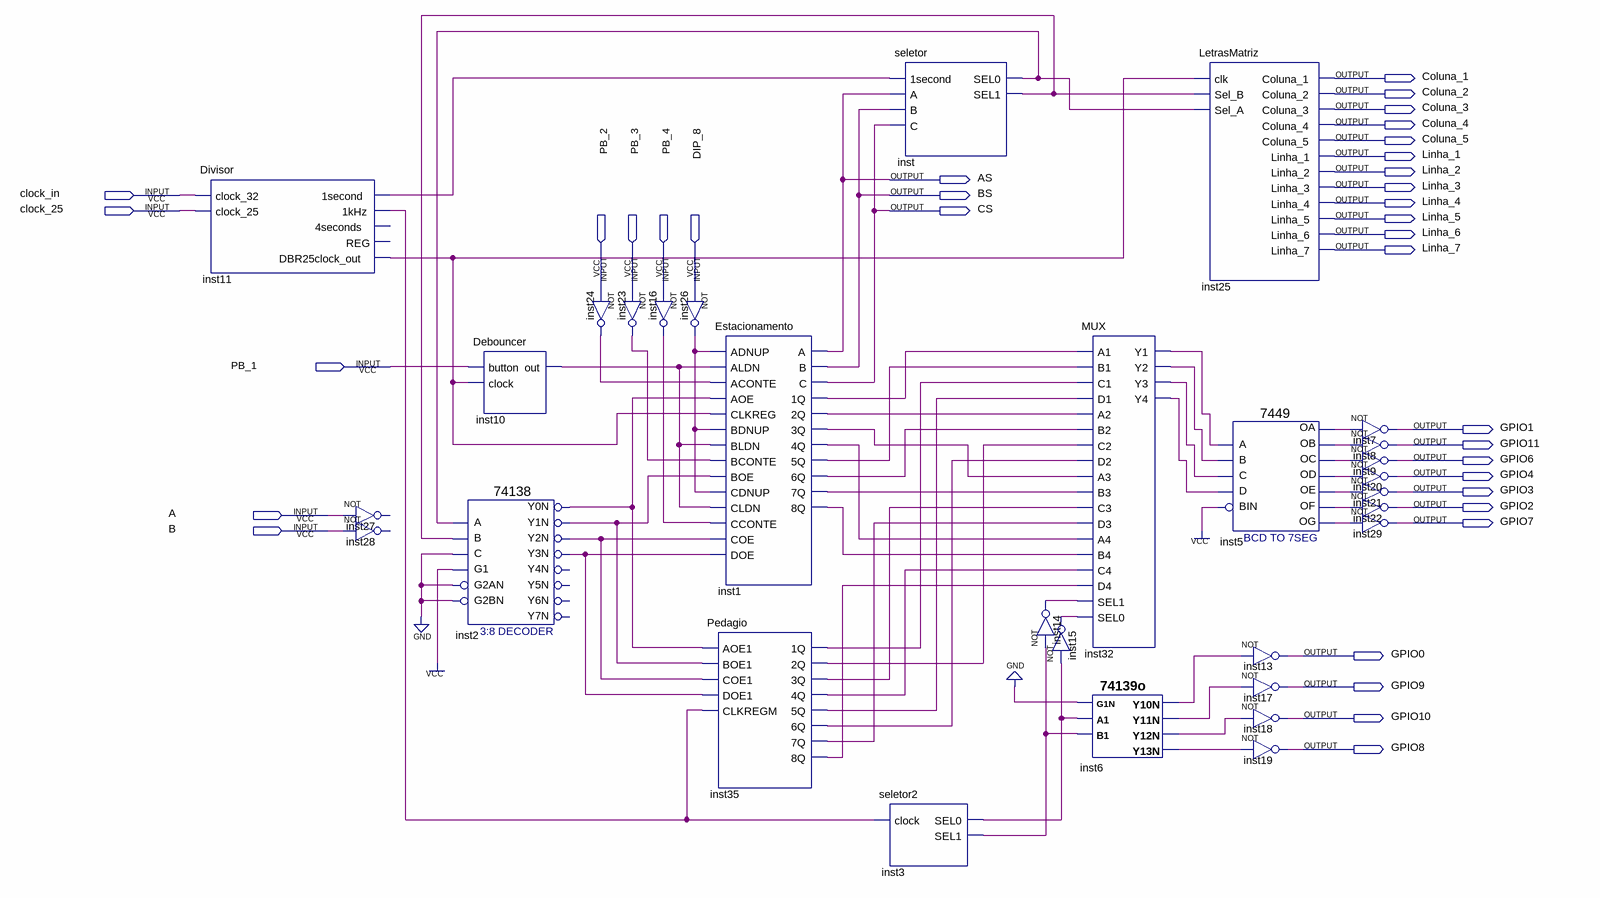
[diagram p0: schematic sheet]
// Quartus schematic Garagem.bdf as structural Verilog: 30 symbols, 35 pins
module Garagem (
  input  clock_in,
  input  clock_25,
  input  PB_2,
  input  PB_3,
  input  PB_4,
  input  DIP_8,
  input  PB_1,
  input  A,
  input  B,
  output Coluna_1,
  output Coluna_2,
  output Coluna_3,
  output Coluna_4,
  output Coluna_5,
  output Linha_1,
  output Linha_2,
  output AS,
  output Linha_3,
  output BS,
  output Linha_4,
  output CS,
  output Linha_5,
  output Linha_6,
  output Linha_7,
  output GPIO1,
  output GPIO11,
  output GPIO6,
  output GPIO4,
  output GPIO3,
  output GPIO2,
  output GPIO7,
  output GPIO0,
  output GPIO9,
  output GPIO10,
  output GPIO8
);

  wire inst1_1q, inst1_2q, inst1_3q, inst1_4q, inst1_5q, inst1_6q, inst1_7q, inst1_8q, inst2_y0n, inst2_y1n,
       inst2_y2n, inst2_y3n, inst3_sel0, inst3_sel1, inst5_oa, inst5_ob, inst5_oc, inst5_od, inst5_oe,
       inst5_of, inst5_og, inst6_y10n, inst6_y11n, inst6_y12n, inst6_y13n, inst10_out, inst11_1khz,
       inst11_1second, inst11_dbr25clock_out, inst14_out, inst15_out, inst16_out, inst23_out, inst24_out,
       inst26_out, inst32_y1, inst32_y2, inst32_y3, inst32_y4, inst35_1q, inst35_2q, inst35_3q, inst35_4q,
       inst35_5q, inst35_6q, inst35_7q, inst35_8q, inst_sel0, inst_sel1;

  Divisor inst11 (
    .clock_32(clock_in), .clock_25(clock_25), .\1second (inst11_1second), .\1kHz (inst11_1khz),
    .DBR25clock_out(inst11_dbr25clock_out));  // open: 4seconds, REG
  // NOT inst27 has open pins: IN=A, OUT=open
  // NOT inst28 has open pins: IN=B, OUT=open
  \74138  inst2 (
    .A(inst_sel0), .B(inst_sel1), .G1(1'b1), .C(1'b0), .G2AN(1'b0), .G2BN(1'b0), .Y0N(inst2_y0n),
    .Y1N(inst2_y1n), .Y2N(inst2_y2n), .Y3N(inst2_y3n));  // open: Y4N, Y5N, Y6N, Y7N
  Debouncer inst10 (.button(PB_1), .clock(inst11_dbr25clock_out), .out(inst10_out));
  not inst23 (inst23_out, PB_3);
  not inst24 (inst24_out, PB_2);
  not inst26 (inst26_out, DIP_8);
  not inst16 (inst16_out, PB_4);
  Pedagio inst35 (
    .AOE1(inst2_y0n), .BOE1(inst2_y1n), .COE1(inst2_y2n), .DOE1(inst2_y3n), .CLKREGM(inst11_1khz),
    .\1Q (inst35_1q), .\2Q (inst35_2q), .\3Q (inst35_3q), .\4Q (inst35_4q), .\5Q (inst35_5q),
    .\6Q (inst35_6q), .\7Q (inst35_7q), .\8Q (inst35_8q));
  Estacionamento inst1 (
    .ADNUP(inst26_out), .ALDN(inst10_out), .ACONTE(inst24_out), .AOE(inst2_y0n),
    .CLKREG(inst11_dbr25clock_out), .BDNUP(inst26_out), .BLDN(inst10_out), .BCONTE(inst23_out),
    .BOE(inst2_y1n), .CDNUP(inst26_out), .CLDN(inst10_out), .CCONTE(inst16_out), .COE(inst2_y2n),
    .DOE(inst2_y3n), .A(AS), .B(BS), .C(CS), .\1Q (inst1_1q), .\2Q (inst1_2q), .\3Q (inst1_3q),
    .\4Q (inst1_4q), .\5Q (inst1_5q), .\6Q (inst1_6q), .\7Q (inst1_7q), .\8Q (inst1_8q));
  seletor inst (.\1second (inst11_1second), .A(AS), .B(BS), .C(CS), .SEL0(inst_sel0), .SEL1(inst_sel1));
  seletor2 inst3 (.clock(inst11_1khz), .SEL0(inst3_sel0), .SEL1(inst3_sel1));
  MUX inst32 (
    .A1(inst1_1q), .B1(inst1_5q), .C1(inst35_1q), .D1(inst35_5q), .A2(inst1_2q), .B2(inst1_6q),
    .C2(inst35_2q), .D2(inst35_6q), .A3(inst1_3q), .B3(inst1_7q), .C3(inst35_3q), .D3(inst35_7q),
    .A4(inst1_4q), .B4(inst1_8q), .C4(inst35_4q), .D4(inst35_8q), .SEL1(inst14_out), .SEL0(inst15_out),
    .Y1(inst32_y1), .Y2(inst32_y2), .Y3(inst32_y3), .Y4(inst32_y4));
  not inst14 (inst14_out, inst3_sel1);
  not inst15 (inst15_out, inst3_sel0);
  \74139o  inst6 (
    .G1N(1'b0), .A1(inst3_sel0), .B1(inst3_sel1), .Y10N(inst6_y10n), .Y11N(inst6_y11n), .Y12N(inst6_y12n),
    .Y13N(inst6_y13n));
  LetrasMatriz inst25 (
    .clk(inst11_dbr25clock_out), .Sel_B(inst_sel1), .Sel_A(inst_sel0), .Coluna_1(Coluna_1),
    .Coluna_2(Coluna_2), .Coluna_3(Coluna_3), .Coluna_4(Coluna_4), .Coluna_5(Coluna_5), .Linha_1(Linha_1),
    .Linha_2(Linha_2), .Linha_3(Linha_3), .Linha_4(Linha_4), .Linha_5(Linha_5), .Linha_6(Linha_6),
    .Linha_7(Linha_7));
  \7449  inst5 (
    .A(inst32_y1), .C(inst32_y3), .B(inst32_y2), .D(inst32_y4), .BIN(1'b1), .OC(inst5_oc), .OD(inst5_od),
    .OF(inst5_of), .OG(inst5_og), .OB(inst5_ob), .OA(inst5_oa), .OE(inst5_oe));
  not inst13 (GPIO0, inst6_y10n);
  not inst17 (GPIO9, inst6_y11n);
  not inst18 (GPIO10, inst6_y12n);
  not inst19 (GPIO8, inst6_y13n);
  not inst7 (GPIO1, inst5_oa);
  not inst8 (GPIO11, inst5_ob);
  not inst9 (GPIO6, inst5_oc);
  not inst20 (GPIO4, inst5_od);
  not inst21 (GPIO3, inst5_oe);
  not inst22 (GPIO2, inst5_of);
  not inst29 (GPIO7, inst5_og);
endmodule
